# EAGLE design regdualsupply (EAGLE 9.6.2)
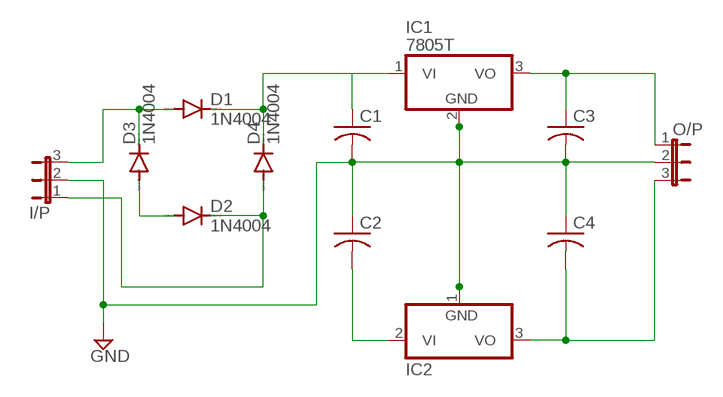
[diagram p0: schematic, sheet 1]

## Parts
C1  C-US025-025X050  [C025-025X050]
C2  C-US025-025X050  [C025-025X050]
C3  C-US025-025X050  [C025-025X050]
C4  C-US025-025X050  [C025-025X050]
D1  1N4004  [DO41-10]
D2  1N4004  [DO41-10]
D3  1N4004  [DO41-10]
D4  1N4004  [DO41-10]
I/P  JP2W  [JP2W]
IC1  7805T  [TO220H]
IC2  7905T  [TO220H]
O/P  JP2W  [JP2W]

## Nets
GND: C1.2 C2.1 C3.2 C4.1 I/P.2 IC1.2(GND) IC2.1(GND) O/P.2
N$1: C1.1 D1.C D4.C IC1.1(VI)
N$2: D1.A D3.C I/P.3
N$5: C3.1 IC1.3(VO) O/P.1
N$6: D2.A D3.A
N$7: C2.2 IC2.2(VI)
N$8: C4.2 IC2.3(VO) O/P.3
N$11: D2.C D4.A I/P.1

## Library data of the parts
C1-C4 = rcl:C-US: CAPACITOR, American symbol; SPICEPREFIX: C
D1-D4 = diode:1N4004: DIODE general purpose rectifier, 1 A
I/P O/P = jumper:JP2W: JUMPER
IC1 = linear:78*: Positive VOLTAGE REGULATOR Source: http://cache.national.com/ds/LM/LM78L05.pdf http://www.fairchildsemi.com/ds/LM/LM7805.pdf
IC2 = linear:79*: Negative VOLTAGE REGULATOR

## Board
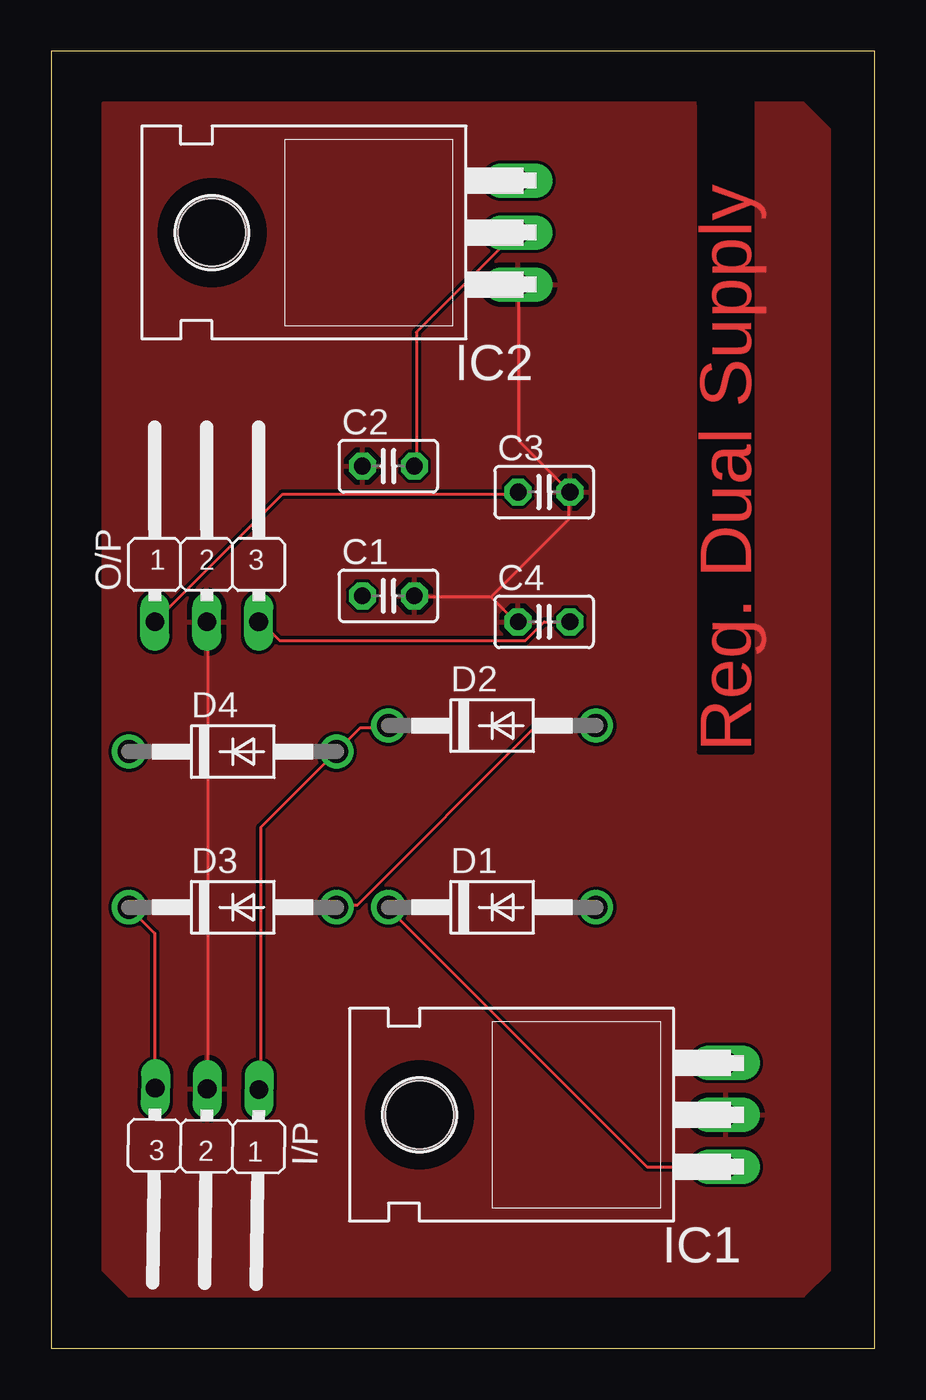
[diagram p1: board, top side]
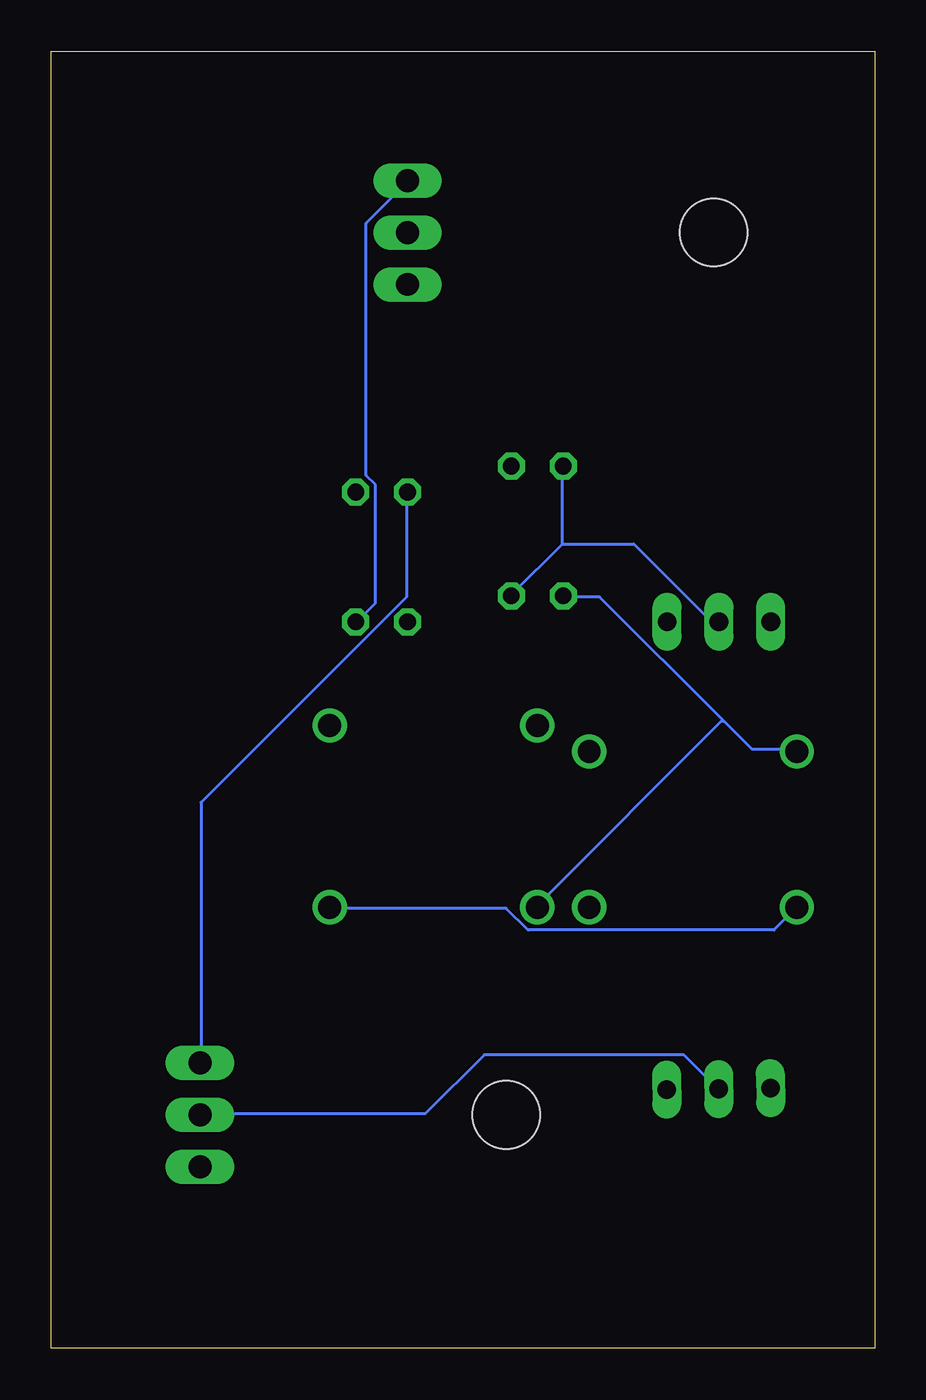
[diagram p2: board, bottom side, seen from below]

Size 40.31 x 63.49 mm. Coordinates in mm from the lower left corner, seen from the top.
Outline: 0,0 40.31,0 40.31,63.49 0,63.49 0,0
Copper layers (1*16): Top 0.035mm / dielectric 1.5mm / Bottom 0.035mm
Design rules "default": minimum track width 6mil, minimum drill 0.35mm, track to track 6mil, track to pad 6mil, pad to pad 6mil, via to via 6mil, smd to smd 6mil, copper to edge 40mil, drill to drill 6mil, minimum pad ring 10mil, minimum via ring 8mil, stop-mask expansion 4mil, vias tented up to drill 0mil, thermal gap 10mil

### Footprints (pad centres in the part's own frame; a part is rotated, then mirrored left to right if it is on the bottom)
C025-025X050 = drill 0.813 octagon: 1 -1.27,0; 2 1.27,0
DO41-10 = drill 1.118: A 5.08,0; C -5.08,0
JP2W = drill 0.914 long: 1 -2.54,-1.27; 2 0,-1.27; 3 2.54,-1.27
TO220H = drill 1.118 long: 1 -2.54,-10.16; 2 0,-10.16; 3 2.54,-10.16 | hole 3.302: 0,4.826

### Placement (x,y rotation side)
C1  16.51,36.83 0 top
C2  16.51,43.18 0 top
C3  24.13,41.91 0 top
C4  24.13,35.56 0 top
D1  21.59,21.59 0 top
D2  21.59,30.48 0 top
D3  8.89,21.59 0 top
D4  8.89,29.21 0 top
I/P  7.62,11.43 179.2 top
IC1  22.86,11.43 90 top
IC2  12.7,54.61 90 top
O/P  7.62,36.83 0 top

### Tracks (layer width: path | path; a pad name or v marks a point on that pad's centre or on a via)
GND
  Top 0.152: 21.54,36.78 17.88,36.78 C1.2 | 21.54,36.78 22.76,35.56 C4.1 | 21.54,36.78 25.35,40.59 25.35,41.81 C3.2 22.91,44.4 22.91,52.02 IC2.1 | I/P.2 7.67,12.7 7.67,35.56 O/P.2
  Bottom 0.152: 15.29,39.37 15.29,43.18 C2.1 | 15.29,39.37 17.73,36.93 C1.2 | O/P.2 7.98,35.56 11.79,39.37 15.29,39.37 | IC1.2 32.97,11.48 22,11.48 19.1,14.38 9.35,14.38 7.67,12.7 I/P.2
  pour Top: 2.54,60.96 36.83,60.96 38.1,59.69 38.1,3.81 36.83,2.54 3.81,2.54 2.54,3.81
N$1
  Top 0.152: IC1.1 29.16,8.89 16.51,21.54 D1.C
  Bottom 0.152: 7.37,30.68 5.99,29.31 3.86,29.31 D4.C | 7.37,30.68 13.46,36.78 15.14,36.78 C1.1 | 7.37,30.68 7.52,30.68 16.51,21.69 D1.C
N$2
  Top 0.152: D3.C 5.08,20.32 5.08,12.85 I/P.3
  Bottom 0.152: D3.C 4.93,20.47 16.97,20.47 18.03,21.54 26.57,21.54 D1.A
N$5
  Top 0.152: O/P.1 9.53,40 | 9.53,40 11.33,41.81 22.76,41.81 C3.1 | 9.53,40
  Bottom 0.152: IC1.3 32.97,14.07 32.97,26.72 22.91,36.78 22.91,41.81 C3.1
N$6
  Top 0.152: D3.A 14.07,21.69 14.99,21.69 23.67,30.38 26.57,30.38 D2.A
N$7
  Top 0.152: C2.2 17.88,43.18 17.88,49.73 22.76,54.61 IC2.2
N$8
  Top 0.152: C4.2 24.13,35.56 23.22,34.65 11.18,34.65 10.26,35.56 O/P.3
  Bottom 0.152: IC2.3 22.91,57.05 24.89,55.07 24.89,42.72 24.43,42.27 24.43,36.47 25.35,35.56 C4.2
N$11
  Top 0.152: I/P.1 10.26,12.7 10.26,25.5 D4.A 15.14,30.38 16.51,30.38 D2.C

### Text on the board
Top: Reg. Dual Supply